# EAGLE design temperature (EAGLE 7.6.0)
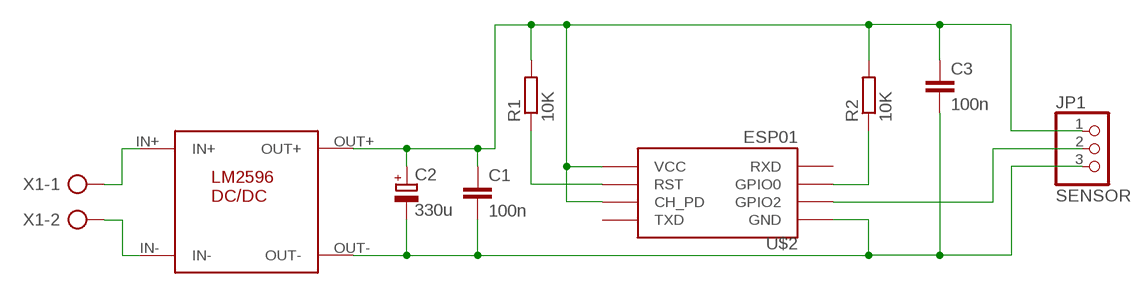
[diagram p0: schematic, sheet 1]

## Parts
C1  100n  C-EU050-024X044  [C050-024X044]
C2  330u  CPOL-EUE2,5-6E  [E2,5-6E]
C3  100n  C-EU050-024X044  [C050-024X044]
JP1  SENSOR  PINHD-1X3  [1X03]
R1  10K  R-EU_0204/7  [0204/7]
R2  10K  R-EU_0204/7  [0204/7]
U$1  LM2596DCDC  [LM2596DCDC]
U$2  ESP01  [ESP01]
X1  AK300/2  [AK300/2]

## Nets
GND: C1.2 C2.- C3.2 JP1.3 U$1.OUT- U$2.GND
N$1: R2.1 U$2.GPIO0
N$2: R1.1 U$2.RST
N$3: U$1.IN+ X1.1
N$4: JP1.2 U$2.GPIO2
N$5: U$1.IN- X1.2
VCC: C1.1 C2.+ C3.1 JP1.1 R1.2 R2.2 U$1.OUT+ U$2.CH_PD U$2.VCC
Unconnected: U$2.RX(RXD) U$2.TX(TXD)

## Library data of the parts
C1 C3 = rcl:C-EU: CAPACITOR, European symbol
C2 = rcl:CPOL-EU: POLARIZED CAPACITOR, European symbol
JP1 = pinhead:PINHD-1X3: PIN HEADER
R1 R2 = rcl:R-EU_: RESISTOR, European symbol
U$1 = LM2596_DCDC:LM2596DCDC
U$2 = esp8266modules:ESP01: ESP8266 Wifi module 01
X1 = con-ptr500:AK300/2: CONNECTOR; OC_FARNELL: unknown; OC_NEWARK: unknown

## Board
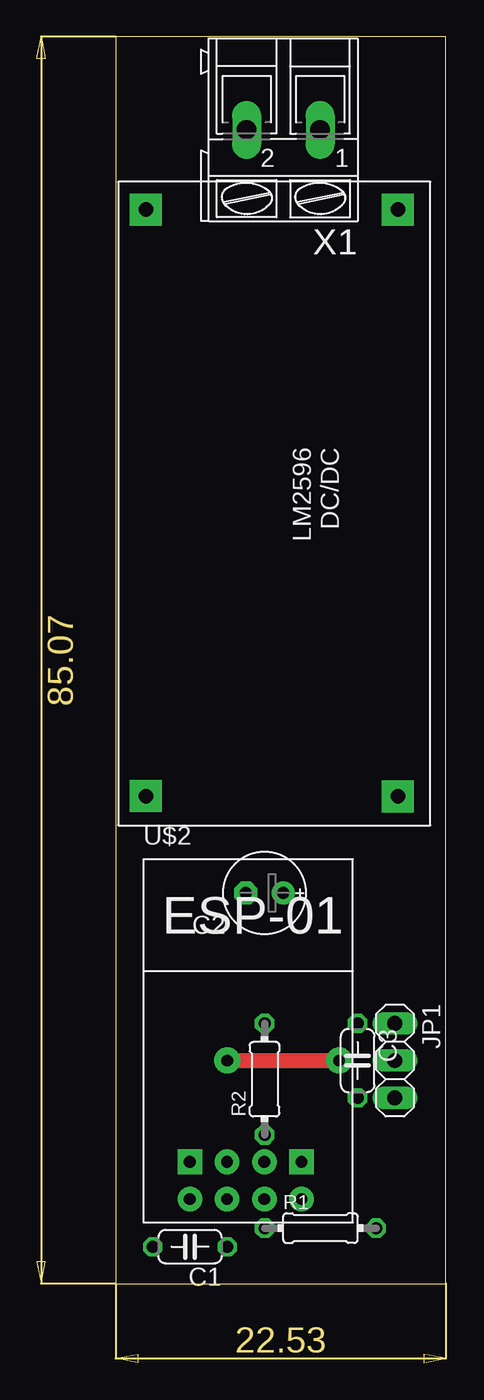
[diagram p1: board, top side]
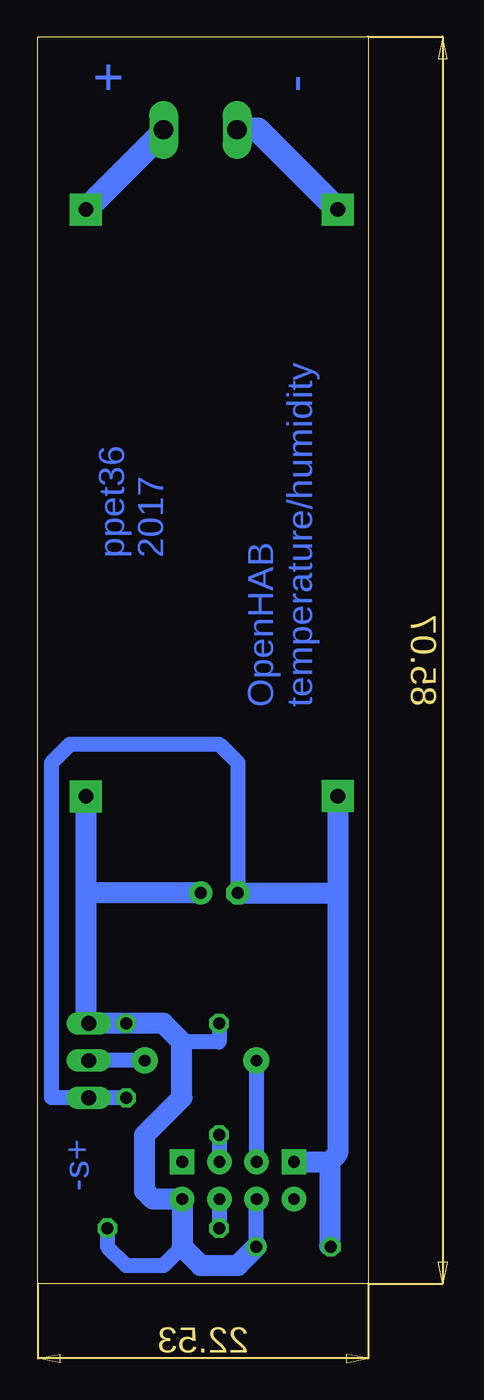
[diagram p2: board, bottom side, seen from below]

Size 22.53 x 85.07 mm. Coordinates in mm from the lower left corner, seen from the top.
Outline: 0,85.07 0,0 22.53,0 22.53,85.07 0,85.07
Copper layers (1*16): Top 0.035mm / dielectric 1.5mm / Bottom 0.035mm
Design rules "default": minimum track width 10mil, minimum drill 24mil, track to track 8mil, track to pad 8mil, pad to pad 8mil, via to via 8mil, smd to smd 8mil, copper to edge 40mil, drill to drill 8mil, minimum pad ring 10mil, minimum via ring 8mil, stop-mask expansion 4mil, vias tented up to drill 0mil, thermal gap 10mil

### Footprints (pad centres in the part's own frame; a part is rotated, then mirrored left to right if it is on the bottom)
C050-024X044 = drill 0.813 octagon: 1 -2.54,0; 2 2.54,0
E2,5-6E = drill 0.813 pad 1.575: + -1.27,0 | drill 0.813 pad 1.575 octagon: - 1.27,0
1X03 = drill 1.016 long: 1 -2.54,0; 2 0,0; 3 2.54,0
0204/7 = drill 0.813 octagon: 1 -3.81,0; 2 3.81,0
LM2596DCDC = drill 1 pad 2.184 square: IN+ -21.23,7.82; IN- -21.23,-9.355; OUT+ 18.805,7.82; OUT- 18.785,-9.355
ESP01 = drill 0.8 pad 1.676: CH_PD -1.285,-8.178; GPIO0 1.255,-5.638; GPIO2 -1.285,-5.638; RST 1.255,-8.178; TX -3.825,-8.178; VCC 3.795,-8.178 | drill 0.8 pad 1.676 square: GND -3.825,-5.638; RX 3.795,-5.638
AK300/2 = drill 1.321 long: 1 -2.515,0; 2 2.489,0

### Placement (x,y rotation side)
C1  5.08,2.52 180 top
C2  10.16,26.65 180 top
C3  16.51,15.22 270 top
JP1  19.05,15.22 270 top
R1  13.97,3.79 0 top
R2  10.16,13.95 90 top
U$1  11.43,52.05 270 top
U$2  8.89,13.95 0 top
X1  11.43,78.72 180 top

### Tracks (layer width: path | path; a pad name or v marks a point on that pad's centre or on a via)
GND
  Bottom 1.016: C2.- 8.89,35.54 10.16,36.81 20.32,36.81 21.59,35.54 21.59,12.68 JP1.3 C3.2 | 2.63,2.61 C1.2
  Bottom 1.422: U$1.OUT- 2.08,26.65 | 2.08,26.65 2.08,8.87 2.63,8.31 | C2.- 2.08,26.65 | U$2.GND 2.63,8.31 | 2.63,8.31 2.63,2.61
N$1
  Bottom 1.016: R2.1 10.16,8.33 U$2.GPIO0
N$2
  Bottom 1.016: U$2.RST 10.14,3.81 R1.1
N$3
  Bottom 1.27: X1.1 13.95,78.59
  Bottom 1.676: 13.95,78.59 U$1.IN+
N$4  (via drill 0.8 pad 1.78)
  Top 1.016: v7.62,15.22 v15.24,15.22
  Bottom 1.016: U$2.GPIO2 7.61,15.21 v7.62,15.22 | v15.24,15.22 JP1.2
N$5
  Bottom 1.676: X1.2 7.51,78.72 U$1.IN-
VCC
  Bottom 1.016: 19.25,17.96 JP1.1 | R1.2 17.78,2.52 16.51,1.25 13.94,1.25 12.69,2.5 | C1.1 7.62,5.76 U$2.CH_PD | R2.2 10.16,16.49 12.7,16.49
  Bottom 1.422: U$1.OUT+ 19.25,26.65 | 19.25,26.65 19.25,17.96 | C2.+ 19.25,26.65 | C1.1 8.89,1.25 11.43,1.25 12.69,2.5 U$2.VCC 14.68,5.77 15.24,6.33 15.24,10.14 12.7,12.68 12.7,16.49 13.97,17.76 C3.1 JP1.1

### Text on the board
Bottom: - | + | ppet36 / 2017 | OpenHAB / temperature/humidity | -s+